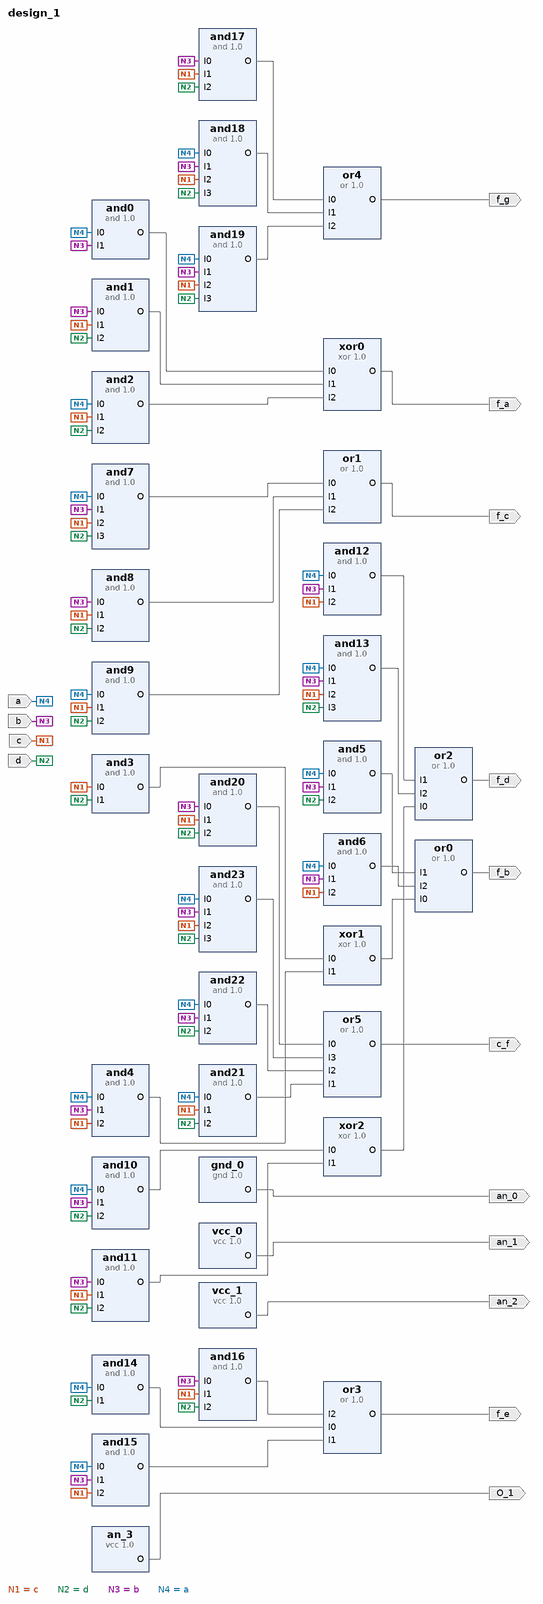
[diagram p0: block diagram of the top level]
# Vivado block design design_1, xc7a35tcpg236-1, Vivado 2018.2.1
create_bd_design design_1

create_bd_port -dir I -type data a
create_bd_port -dir I -type data b
create_bd_port -dir I -type data c
create_bd_port -dir I -type data d
create_bd_port -dir O -type data f_a
create_bd_port -dir O -type data f_b
create_bd_port -dir O -type data f_c
create_bd_port -dir O -type data f_d
create_bd_port -dir O -type data f_e
create_bd_port -dir O -type data f_g
create_bd_port -dir O an_0
create_bd_port -dir O an_1
create_bd_port -dir O an_2
create_bd_port -dir O O_1
create_bd_port -dir O -type data c_f

create_bd_cell -type ip -vlnv FIT:user:and:1.0 and0
set_property -dict {CONFIG.I1_inverted true} [get_bd_cells and0]
create_bd_cell -type ip -vlnv FIT:user:and:1.0 and1
set_property -dict {CONFIG.Inputs 3 CONFIG.I0_Inverted true CONFIG.I2_inverted true} [get_bd_cells and1]
create_bd_cell -type ip -vlnv FIT:user:and:1.0 and2
set_property -dict {CONFIG.Inputs 3 CONFIG.I1_inverted true} [get_bd_cells and2]
create_bd_cell -type ip -vlnv FIT:user:xor:1.0 xor0
set_property -dict {CONFIG.Inputs 3} [get_bd_cells xor0]
create_bd_cell -type ip -vlnv FIT:user:and:1.0 and4
set_property -dict {CONFIG.Inputs 3 CONFIG.I1_inverted true} [get_bd_cells and4]
create_bd_cell -type ip -vlnv FIT:user:and:1.0 and3
create_bd_cell -type ip -vlnv FIT:user:xor:1.0 xor1
create_bd_cell -type ip -vlnv FIT:user:and:1.0 and5
set_property -dict {CONFIG.Inputs 3} [get_bd_cells and5]
create_bd_cell -type ip -vlnv FIT:user:and:1.0 and6
set_property -dict {CONFIG.Inputs 3 CONFIG.I0_Inverted true} [get_bd_cells and6]
create_bd_cell -type ip -vlnv FIT:user:or:1.0 or0
set_property -dict {CONFIG.Inputs 3} [get_bd_cells or0]
create_bd_cell -type ip -vlnv FIT:user:and:1.0 and7
set_property -dict {CONFIG.Inputs 4 CONFIG.I0_Inverted true CONFIG.I2_inverted true CONFIG.I3_inverted true} [get_bd_cells and7]
create_bd_cell -type ip -vlnv FIT:user:and:1.0 and8
set_property -dict {CONFIG.Inputs 3} [get_bd_cells and8]
create_bd_cell -type ip -vlnv FIT:user:and:1.0 and9
set_property -dict {CONFIG.Inputs 3 CONFIG.I0_Inverted true} [get_bd_cells and9]
create_bd_cell -type ip -vlnv FIT:user:or:1.0 or1
set_property -dict {CONFIG.Inputs 3} [get_bd_cells or1]
create_bd_cell -type ip -vlnv FIT:user:and:1.0 and10
set_property -dict {CONFIG.Inputs 3 CONFIG.I1_inverted true CONFIG.I2_inverted true} [get_bd_cells and10]
create_bd_cell -type ip -vlnv FIT:user:and:1.0 and11
set_property -dict {CONFIG.Inputs 3 CONFIG.I0_Inverted true CONFIG.I2_inverted true} [get_bd_cells and11]
create_bd_cell -type ip -vlnv FIT:user:and:1.0 and12
set_property -dict {CONFIG.Inputs 3} [get_bd_cells and12]
create_bd_cell -type ip -vlnv FIT:user:and:1.0 and13
set_property -dict {CONFIG.Inputs 4 CONFIG.I0_Inverted true CONFIG.I2_inverted true} [get_bd_cells and13]
create_bd_cell -type ip -vlnv FIT:user:xor:1.0 xor2
create_bd_cell -type ip -vlnv FIT:user:or:1.0 or2
set_property -dict {CONFIG.Inputs 3} [get_bd_cells or2]
create_bd_cell -type ip -vlnv FIT:user:and:1.0 and14
set_property -dict {CONFIG.I1_inverted true} [get_bd_cells and14]
create_bd_cell -type ip -vlnv FIT:user:and:1.0 and15
set_property -dict {CONFIG.Inputs 3 CONFIG.I1_inverted true CONFIG.I2_inverted true} [get_bd_cells and15]
create_bd_cell -type ip -vlnv FIT:user:and:1.0 and16
set_property -dict {CONFIG.Inputs 3 CONFIG.I0_Inverted true CONFIG.I2_inverted true} [get_bd_cells and16]
create_bd_cell -type ip -vlnv FIT:user:or:1.0 or3
set_property -dict {CONFIG.Inputs 3} [get_bd_cells or3]
create_bd_cell -type ip -vlnv FIT:user:and:1.0 and17
set_property -dict {CONFIG.Inputs 3 CONFIG.I0_Inverted true CONFIG.I1_inverted true CONFIG.I2_inverted true} [get_bd_cells and17]
create_bd_cell -type ip -vlnv FIT:user:and:1.0 and18
set_property -dict {CONFIG.Inputs 4 CONFIG.I0_Inverted true CONFIG.I1_inverted true} [get_bd_cells and18]
create_bd_cell -type ip -vlnv FIT:user:and:1.0 and19
set_property -dict {CONFIG.Inputs 4 CONFIG.I3_inverted true} [get_bd_cells and19]
create_bd_cell -type ip -vlnv FIT:user:or:1.0 or4
set_property -dict {CONFIG.Inputs 3} [get_bd_cells or4]
create_bd_cell -type ip -vlnv FIT:user:gnd:1.0 gnd_0
create_bd_cell -type ip -vlnv FIT:user:vcc:1.0 vcc_0
create_bd_cell -type ip -vlnv FIT:user:vcc:1.0 vcc_1
create_bd_cell -type ip -vlnv FIT:user:vcc:1.0 an_3
create_bd_cell -type ip -vlnv FIT:user:and:1.0 and20
set_property -dict {CONFIG.Inputs 3 CONFIG.I1_inverted true CONFIG.I2_inverted true} [get_bd_cells and20]
create_bd_cell -type ip -vlnv FIT:user:and:1.0 and21
set_property -dict {CONFIG.Inputs 3 CONFIG.I1_inverted true CONFIG.I2_inverted true} [get_bd_cells and21]
create_bd_cell -type ip -vlnv FIT:user:and:1.0 and22
set_property -dict {CONFIG.Inputs 3 CONFIG.I2_inverted true} [get_bd_cells and22]
create_bd_cell -type ip -vlnv FIT:user:and:1.0 and23
set_property -dict {CONFIG.Inputs 4 CONFIG.I1_inverted true} [get_bd_cells and23]
create_bd_cell -type ip -vlnv FIT:user:or:1.0 or5
set_property -dict {CONFIG.Inputs 4} [get_bd_cells or5]

# ---- connections ----

connect_bd_net [get_bd_pins and0/O] [get_bd_pins xor0/I0]
connect_bd_net -net I1_0_2 [get_bd_ports c] \
  [get_bd_pins and1/I1] [get_bd_pins and2/I1] [get_bd_pins and3/I0] [get_bd_pins and4/I2] [get_bd_pins and6/I2] \
  [get_bd_pins and7/I2] [get_bd_pins and8/I1] [get_bd_pins and9/I1] [get_bd_pins and11/I1] [get_bd_pins and12/I2] \
  [get_bd_pins and13/I2] [get_bd_pins and15/I2] [get_bd_pins and16/I1] [get_bd_pins and17/I1] [get_bd_pins and18/I2] \
  [get_bd_pins and19/I2] [get_bd_pins and20/I1] [get_bd_pins and21/I1] [get_bd_pins and23/I2]
connect_bd_net -net I2_0_1 [get_bd_ports d] \
  [get_bd_pins and1/I2] [get_bd_pins and2/I2] [get_bd_pins and3/I1] [get_bd_pins and5/I2] [get_bd_pins and7/I3] \
  [get_bd_pins and8/I2] [get_bd_pins and9/I2] [get_bd_pins and10/I2] [get_bd_pins and11/I2] [get_bd_pins and13/I3] \
  [get_bd_pins and14/I1] [get_bd_pins and16/I2] [get_bd_pins and17/I2] [get_bd_pins and18/I3] [get_bd_pins and19/I3] \
  [get_bd_pins and20/I2] [get_bd_pins and21/I2] [get_bd_pins and22/I2] [get_bd_pins and23/I3]
connect_bd_net [get_bd_pins and1/O] [get_bd_pins xor0/I1]
connect_bd_net [get_bd_pins and2/O] [get_bd_pins xor0/I2]
connect_bd_net [get_bd_pins xor0/O] [get_bd_ports f_a]
connect_bd_net [get_bd_pins and3/O] [get_bd_pins xor1/I0]
connect_bd_net [get_bd_pins and4/O] [get_bd_pins xor1/I1]
connect_bd_net [get_bd_pins xor1/O] [get_bd_pins or0/I0]
connect_bd_net [get_bd_pins and5/O] [get_bd_pins or0/I1]
connect_bd_net [get_bd_pins and6/O] [get_bd_pins or0/I2]
connect_bd_net [get_bd_pins or0/O] [get_bd_ports f_b]
connect_bd_net [get_bd_pins and7/O] [get_bd_pins or1/I0]
connect_bd_net [get_bd_pins and8/O] [get_bd_pins or1/I1]
connect_bd_net [get_bd_pins and9/O] [get_bd_pins or1/I2]
connect_bd_net [get_bd_pins or1/O] [get_bd_ports f_c]
connect_bd_net [get_bd_pins and10/O] [get_bd_pins xor2/I0]
connect_bd_net [get_bd_pins and11/O] [get_bd_pins xor2/I1]
connect_bd_net [get_bd_pins xor2/O] [get_bd_pins or2/I0]
connect_bd_net [get_bd_pins and12/O] [get_bd_pins or2/I1]
connect_bd_net [get_bd_pins and13/O] [get_bd_pins or2/I2]
connect_bd_net [get_bd_pins or2/O] [get_bd_ports f_d]
connect_bd_net [get_bd_pins and14/O] [get_bd_pins or3/I0]
connect_bd_net [get_bd_pins and15/O] [get_bd_pins or3/I1]
connect_bd_net [get_bd_pins and16/O] [get_bd_pins or3/I2]
connect_bd_net [get_bd_pins or3/O] [get_bd_ports f_e]
connect_bd_net [get_bd_pins and17/O] [get_bd_pins or4/I0]
connect_bd_net [get_bd_pins and18/O] [get_bd_pins or4/I1]
connect_bd_net [get_bd_pins and19/O] [get_bd_pins or4/I2]
connect_bd_net [get_bd_pins or4/O] [get_bd_ports f_g]
connect_bd_net [get_bd_pins gnd_0/O] [get_bd_ports an_0]
connect_bd_net [get_bd_pins vcc_0/O] [get_bd_ports an_1]
connect_bd_net [get_bd_pins vcc_1/O] [get_bd_ports an_2]
connect_bd_net -net vcc_2_O [get_bd_pins an_3/O] [get_bd_ports O_1]
connect_bd_net [get_bd_pins and20/O] [get_bd_pins or5/I0]
connect_bd_net [get_bd_pins or5/O] [get_bd_ports c_f]
connect_bd_net -net I1_0_1 [get_bd_ports b] \
  [get_bd_pins and0/I1] [get_bd_pins and1/I0] [get_bd_pins and4/I1] [get_bd_pins and5/I1] [get_bd_pins and6/I1] \
  [get_bd_pins and7/I1] [get_bd_pins and8/I0] [get_bd_pins and10/I1] [get_bd_pins and11/I0] [get_bd_pins and12/I1] \
  [get_bd_pins and13/I1] [get_bd_pins and15/I1] [get_bd_pins and16/I0] [get_bd_pins and17/I0] [get_bd_pins and18/I1] \
  [get_bd_pins and19/I1] [get_bd_pins and20/I0] [get_bd_pins and22/I1] [get_bd_pins and23/I1]
connect_bd_net -net I0_0_1 [get_bd_ports a] \
  [get_bd_pins and0/I0] [get_bd_pins and2/I0] [get_bd_pins and4/I0] [get_bd_pins and5/I0] [get_bd_pins and6/I0] \
  [get_bd_pins and7/I0] [get_bd_pins and9/I0] [get_bd_pins and10/I0] [get_bd_pins and12/I0] [get_bd_pins and13/I0] \
  [get_bd_pins and14/I0] [get_bd_pins and15/I0] [get_bd_pins and18/I0] [get_bd_pins and19/I0] [get_bd_pins and21/I0] \
  [get_bd_pins and22/I0] [get_bd_pins and23/I0]
connect_bd_net [get_bd_pins and23/O] [get_bd_pins or5/I3]
connect_bd_net [get_bd_pins and22/O] [get_bd_pins or5/I2]
connect_bd_net [get_bd_pins and21/O] [get_bd_pins or5/I1]

validate_bd_design
save_bd_design
